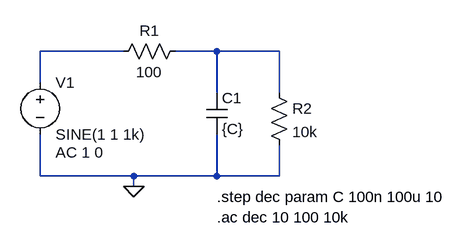
[diagram p0: schematic CL1_T2_LowPassFilter.asc]
CL1_T2_LowPassFilter.asc, the LTspice schematic file:
Version 4.1
SHEET 1 880 680
WIRE 224 80 96 80
WIRE 368 80 304 80
WIRE 464 80 368 80
WIRE 96 128 96 80
WIRE 368 144 368 80
WIRE 464 144 464 80
WIRE 96 272 96 208
WIRE 240 272 96 272
WIRE 368 272 368 208
WIRE 368 272 240 272
WIRE 464 272 464 224
WIRE 464 272 368 272
WIRE 240 288 240 272
FLAG 240 288 0
SYMBOL voltage 96 112 R0
WINDOW 123 24 124 Left 2
WINDOW 39 0 0 Left 0
SYMATTR InstName V1
SYMATTR Value SINE(1 1 1k)
SYMATTR Value2 AC 1 0
SYMBOL res 320 64 R90
WINDOW 0 0 56 VBottom 2
WINDOW 3 32 56 VTop 2
SYMATTR InstName R1
SYMATTR Value 100
SYMBOL res 448 128 R0
SYMATTR InstName R2
SYMATTR Value 10k
SYMBOL cap 352 144 R0
SYMATTR InstName C1
SYMATTR Value {C}
TEXT 368 304 Left 2 !.step dec param C 100n 100u 10
TEXT 368 336 Left 2 !.ac dec 10 100 10k

The netlist it stands for:
* CL1_T2_LowPassFilter.asc
V1 N001 0 SINE(1 1 1k) AC 1 0
R1 N002 N001 100
R2 N002 0 10k
C1 N002 0 {C}
.step dec param C 100n 100u 10
.ac dec 10 100 10k
.backanno
.end